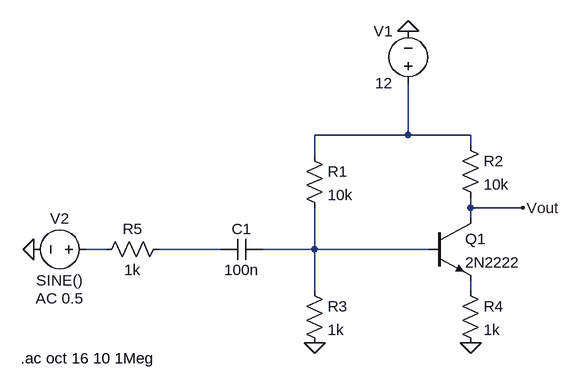
[diagram p0: schematic D1-DÇ1.asc]
D1-DÇ1.asc, the LTspice schematic file:
Version 4
SHEET 1 880 680
WIRE 256 0 256 -80
WIRE 256 0 112 0
WIRE 352 0 256 0
WIRE 352 16 352 0
WIRE 112 32 112 0
WIRE 352 112 352 96
WIRE 432 112 352 112
WIRE 352 128 352 112
WIRE -208 176 -240 176
WIRE -32 176 -128 176
WIRE 112 176 112 112
WIRE 112 176 32 176
WIRE 288 176 112 176
WIRE 112 240 112 176
WIRE 352 240 352 224
FLAG 432 112 Vout
FLAG 112 320 0
FLAG 352 320 0
FLAG -320 176 0
FLAG 256 -160 0
SYMBOL res 96 16 R0
SYMATTR InstName R1
SYMATTR Value 10k
SYMBOL res 336 0 R0
SYMATTR InstName R2
SYMATTR Value 10k
SYMBOL res 96 224 R0
SYMATTR InstName R3
SYMATTR Value 1k
SYMBOL res 336 224 R0
SYMATTR InstName R4
SYMATTR Value 1k
SYMBOL res -112 160 R90
WINDOW 0 0 56 VBottom 2
WINDOW 3 32 56 VTop 2
SYMATTR InstName R5
SYMATTR Value 1k
SYMBOL cap -32 192 R270
WINDOW 0 32 32 VTop 2
WINDOW 3 0 32 VBottom 2
SYMATTR InstName C1
SYMATTR Value 100n
SYMBOL npn 288 128 R0
SYMATTR InstName Q1
SYMATTR Value 2N2222
SYMBOL voltage -224 176 R90
WINDOW 0 -32 56 VBottom 2
WINDOW 3 32 56 VTop 2
WINDOW 123 60 56 VTop 2
WINDOW 39 0 0 Left 0
SYMATTR InstName V2
SYMATTR Value SINE()
SYMATTR Value2 AC 0.5
SYMBOL voltage 256 -64 R180
WINDOW 0 24 96 Left 2
WINDOW 3 24 16 Left 2
WINDOW 123 0 0 Left 0
WINDOW 39 0 0 Left 0
SYMATTR InstName V1
SYMATTR Value 12
TEXT -340 344 Left 2 !.ac oct 16 10 1Meg

The netlist it stands for:
* D1-DÇ1.asc
R1 N001 N004 10k
R2 N001 Vout 10k
R3 N004 0 1k
R4 N005 0 1k
R5 N003 N002 1k
C1 N003 N004 100n
Q1 Vout N004 N005 0 2N2222
V2 N002 0 SINE() AC 0.5
V1 N001 0 12
.model NPN NPN
.model PNP PNP
.lib standard.bjt
.ac oct 16 10 1Meg
.backanno
.end